# EasyEDA Pro project project-rp2350-board.epro, schematic Schematic1
Board Name: Board1; Create Date: 2025-04-15; Page Name: P1; Project Name: rp2350-impa-noaouto; Schematic Name: Schematic1; Update Date: 2025-06-25; Company: EasyEDA.com; Page Size: A4; Version: V1.0
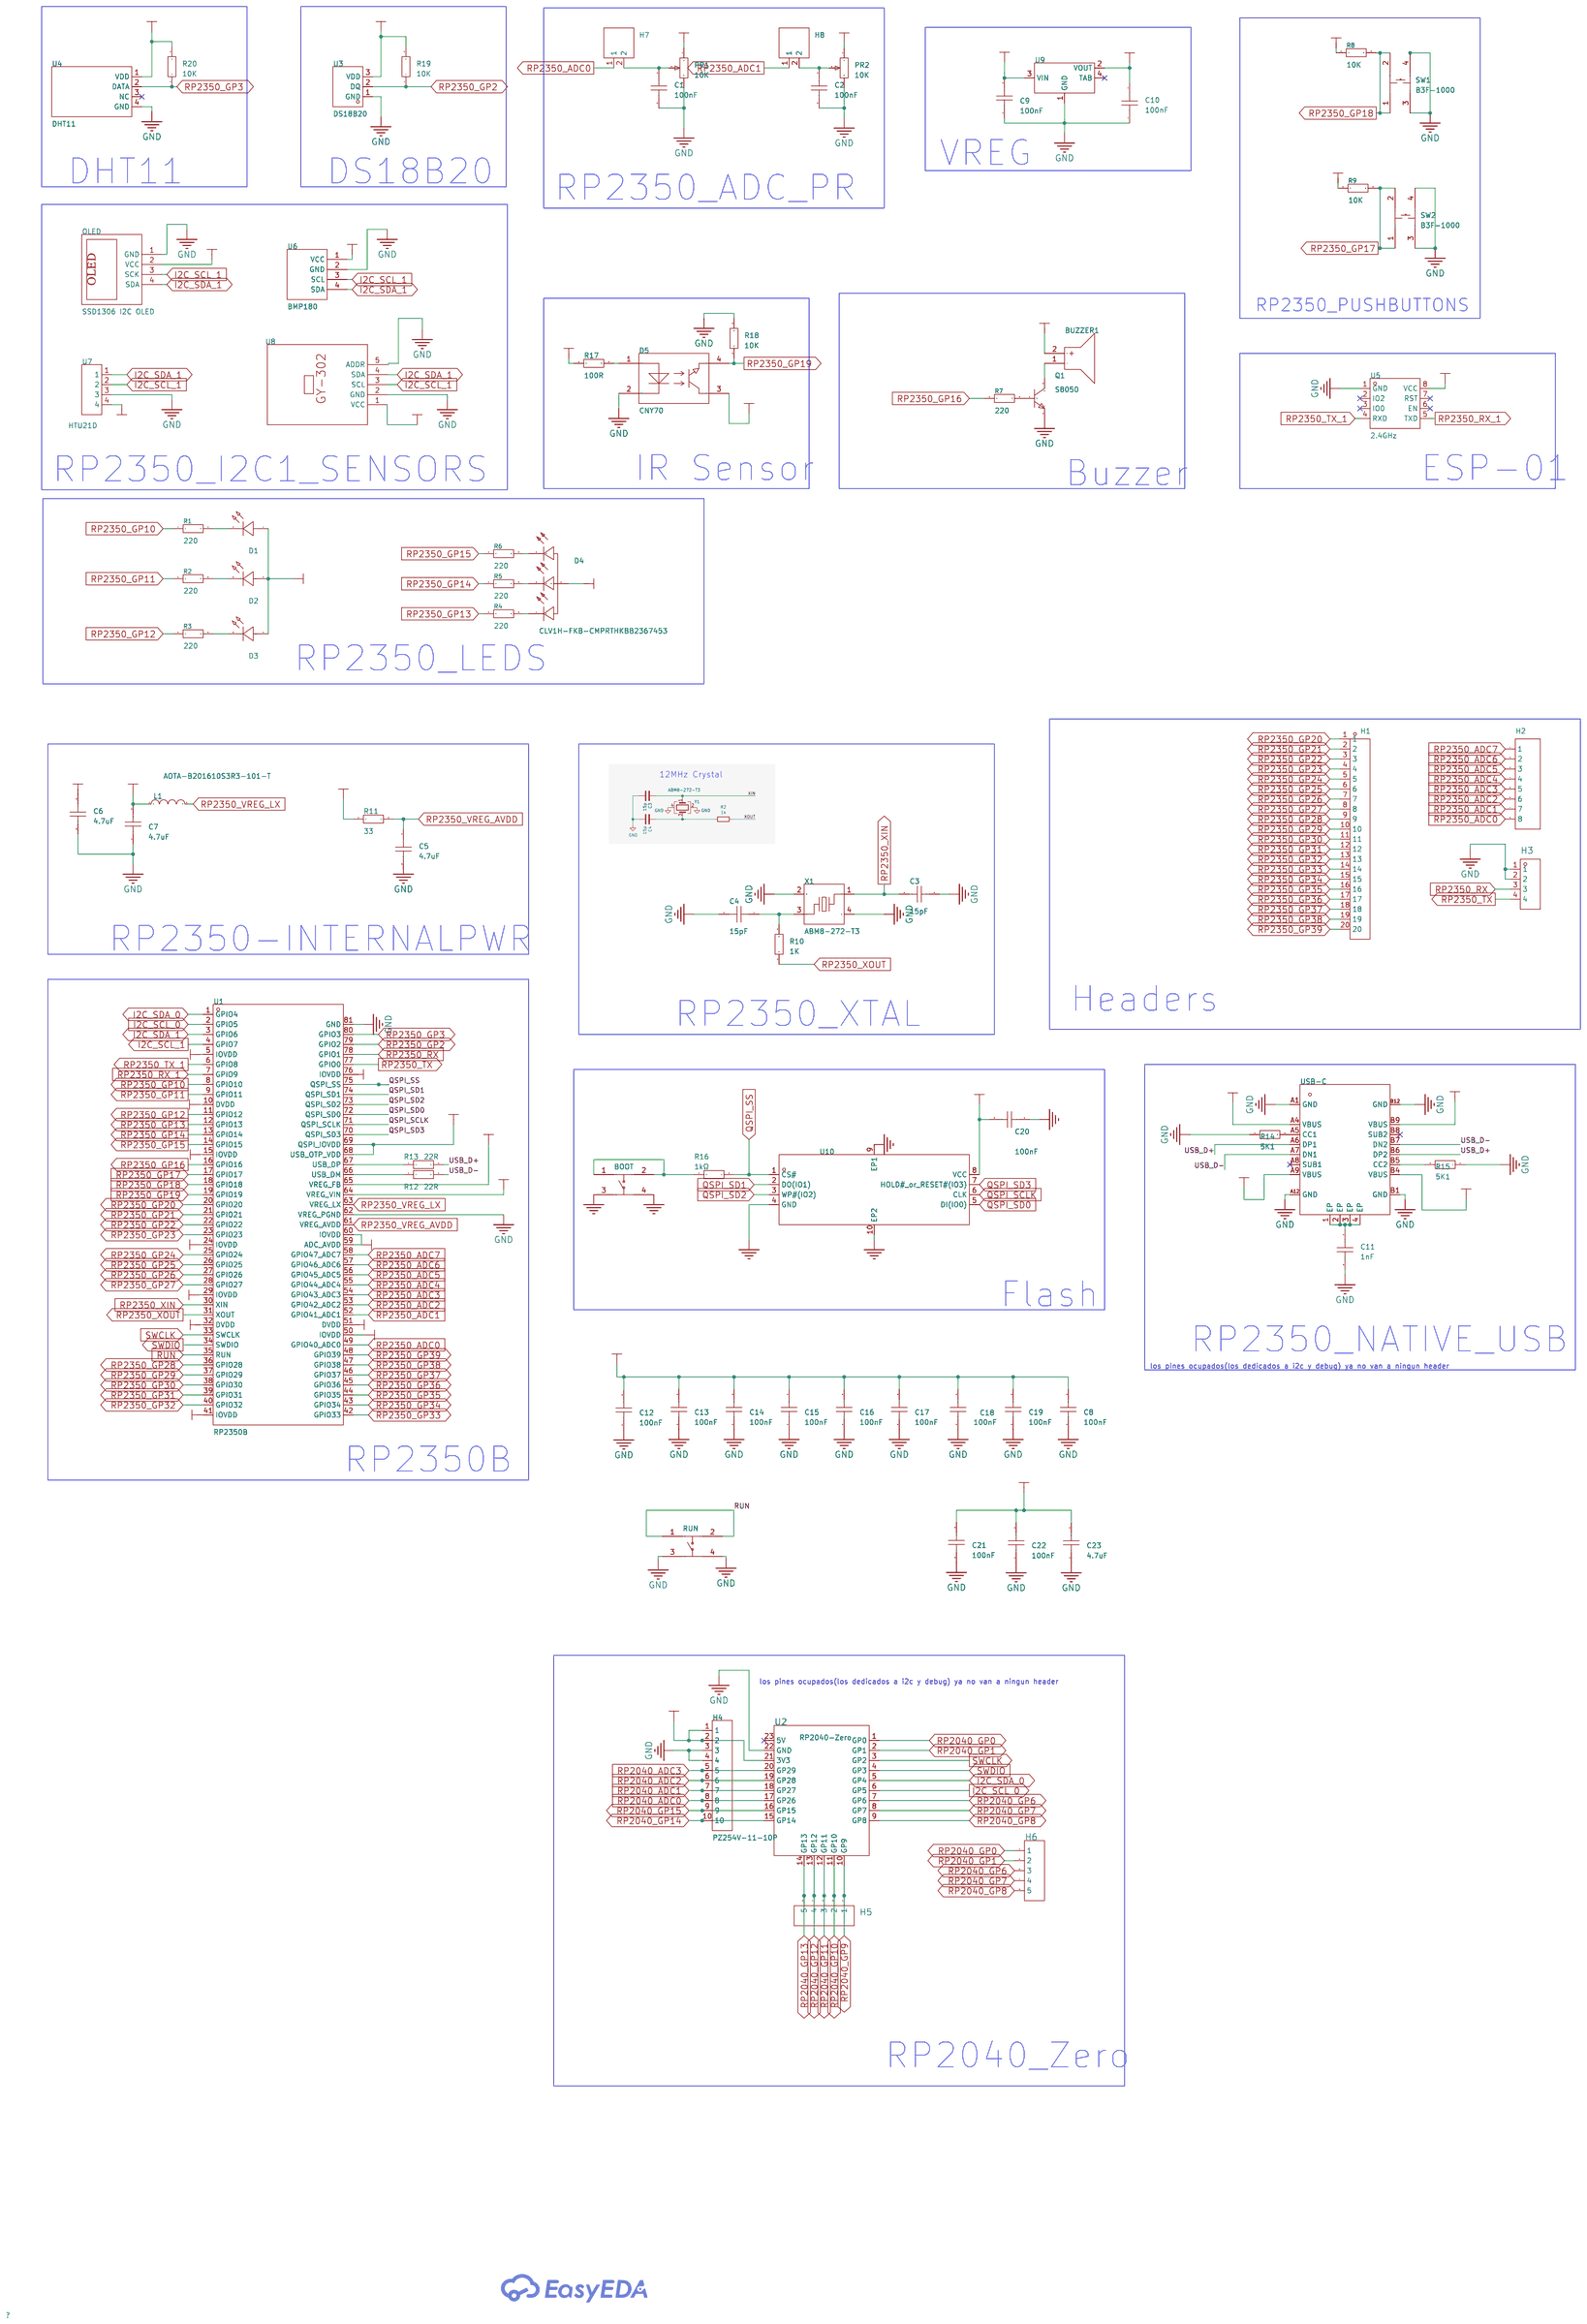
[diagram p0: schematic sheet]

## Parts
BOOT  K2-1808SN-A4SW-01  [KEY-SMD_4P-L4.2-W3.2-P2.20-LS5.1-TL]
BUZZER1  buzzer  [BUZ-TH_BD12.0-P6.00-D0.9-RD]
C1  100nF  [C0603]
C2  100nF  [C0603]
C3  15pF  [C0402]
C4  15pF  [C0402]
C5  4.7uF  [C0603]
C6  4.7uF  [C0603]
C7  4.7uF  [C0603]
C8  100nF  [C0402]
C9  100nF  [C0603]
C10  100nF  [C0603]
C11  1nF  [C0603]
C12  100nF  [C0402]
C13  100nF  [C0402]
C14  100nF  [C0402]
C15  100nF  [C0402]
C16  100nF  [C0402]
C17  100nF  [C0402]
C18  100nF  [C0402]
C19  100nF  [C0402]
C20  100nF  [C0603]
C21  100nF  [C0402]
C22  100nF  [C0402]
C23  4.7uF  [C0402]
D1  YLED0805W  [LED0805-R-RD_WHITE]
D2  YLED0805W  [LED0805-R-RD_WHITE]
D3  YLED0805W  [LED0805-R-RD_WHITE]
D4  CLV1H-FKB-CMPRTHKBB2367453  [LED-SMD_4P-L3.2-W2.8-LS3.5-TL-B]
D5  CNY70  [OPTO-TH_CNY70]
H1  -  [HDR-TH_20P-P2.54-V-M-1]
H2  -  [HDR-TH_8P-P2.54-V-M]
H3  -  [HDR-TH_4P-P2.54-V-F]
H4  PZ254V-11-10P  [HDR-TH_10P-P2.54-V-M-1]
H5  -  [HDR-TH_5P-P2.54-V-F]
H6  -  [HDR-TH_5P-P2.54-V-F]
H7  -  [HDR-TH_2P-P2.54-V-M-1]
H8  -  [HDR-TH_2P-P2.54-V-M-1]
L1  AOTA-B201610S3R3-101-T  [IND-SMD_L2.0-W1.6_AOTA-B201610S3R3-101-T]
OLED  SSD1306 I2C OLED  [OLED_0.91_128X32]
PR1  10K  [RES-ADJ-TH_3P-L9.5-W9.5-P2.54-BR-BS]
PR2  10K  [RES-ADJ-TH_3P-L9.5-W9.5-P2.54-BR-BS]
Q1  S8050  [SOT-23-3_L2.9-W1.3-P1.90-LS2.4-BR]
R1  33kΩ  [R0805]
R2  33kΩ  [R0805]
R3  33kΩ  [R0805]
R4  33kΩ  [R0805]
R5  33kΩ  [R0805]
R6  33kΩ  [R0805]
R7  33kΩ  [R0805]
R8  33kΩ  [R0805]
R9  33kΩ  [R0805]
R10  1K  [R0805]
R11  33  [R0805]
R12  22R  [R0805]
R13  22R  [R0805]
R14  5K1  [R0805]
R15  5K1  [R0805]
R16  1kΩ  [R0805]
R17  100R  [R0805]
R18  10K  [R0805]
R19  10K  [R0805]
R20  10K  [R0805]
RUN  K2-1808SN-A4SW-01  [KEY-SMD_4P-L4.2-W3.2-P2.20-LS5.1-TL]
SW1  B3F-1000  [KEY-TH_4P-L6.2-W6.2-P4.50-LS6.5]
SW2  B3F-1000  [KEY-TH_4P-L6.2-W6.2-P4.50-LS6.5]
U1  RP2350B  [QFN-80_L10.0-W10.0-P0.40-TL-EP3.4]
U2  RP2040-Zero  [COMM-SMD_RP2040-ZERO]
U3  DS18B20  [TO-92-3_L4.8-W3.7-P2.54-R]
U4  DHT11  [SENSOR-TH_DHT11_90DEG]
U5  2.4GHz  [WIFIM-TH_8P-L24.7-W14.4-P2.54]
U6  BMP180  [BMP-180]
U7  HTU21D  [HDR-TH_4P-P2.54-V-M]
U8  -  [GY-302 (BH1750)]
U9  -  [SOT-223-4_L6.5-W3.5-P2.30-LS7.0-BR]
U10  W25Q32JVUUIQ  [USON-8_L4.0-W3.0-P0.80-BL_WINBOND_UU]
USB-C  -  [USB-C-SMD_KH-TYPE-C-16P]
X1  ABM8-272-T3  [CRYSTAL-SMD_4P-L3.2-W2.5-BL]

## Library data of the parts
BOOT RUN = K2-1808SN-A4SW-01: 触点电流:50mA;额定电压(DC):12V;绝缘电阻:100MΩ;电路结构:单刀单掷;安装方式:立贴;按钮形状:椭圆形按钮;带灯:-;作用力:250gf@±30gf;机械寿命:100000;工作温度:-25℃~+85℃;开关长度:4.2mm;开关宽度:3.25mm;开关高度:2.5mm;; Circuit: 单刀单掷; Supplier: LCSC; Datasheet: https://atta.szlcsc.com/upload/public/pdf/source/20180927/C283535_7E7907F3E7B6C1691E1DC87E363D082A.pdf; Manufacturer: 韩国韩荣; Switch Width: 3.25mm; Supplier Part: C92589; Switch Height: 2.5mm; Switch Length: 4.2mm; Actuator Style: 椭圆形按钮; LCSC Part Name: 4.2mm*3.25mm; Mounting Sytle: 立贴; Contact Current: 50mA; Mechanical Life: 100000; Operating Force: 250gf@±30gf; JLCPCB Part Class: Extended Part; Supplier Footprint: SMD; Voltage Rating (DC): 12V; Insulation Resistance: 100MΩ; Operating Temperature: -25℃~+85℃
BUZZER1 = buzzer: Supplier Part: C9900014030; JLCPCB Part Class: Extended Part; Supplier: LCSC
C1-C19 C21-C23 = CAP_0201: Supplier Footprint: 0201
C20 = UMK105B7104KVHF: 容值:100nF;精度:±10%;额定电压:50V;材质(温度系数):X7R;; Supplier: LCSC; Datasheet: https://atta.szlcsc.com/upload/public/pdf/source/20190415/C386112_8E88B4AA4AA3A856ADC8B10D69A4BB16.pdf; Tolerance: ±10%; Manufacturer: TAIYO YUDEN(太诱); Supplier Part: C386112; Voltage Rated: 50V; LCSC Part Name: 100nF ±10% 50V UMK105B7104KVHF; JLCPCB Part Class: Extended Part; Supplier Footprint: 0402; Temperature Coefficient: X7R
D1-D3 = YLED0805W: LCSC Part Name: 发光管; Supplier Part: C25170729; Manufacturer: YONGYUTAI(永裕泰); Supplier Footprint: 0805; JLCPCB Part Class: Extended Part; Datasheet: https://atta.szlcsc.com/upload/public/pdf/source/20240703/126B208D660AB42951DB015B878B749A.pdf; Supplier: LCSC
D4 = CLV1H-FKB-CMPRTHKBB2367453: Diode Configuration:Common Anode; Supplier Part: C6883191; Manufacturer: Wolfspeed; Supplier Footprint: PLCC-4; JLCPCB Part Class: Extended Part; Supplier: LCSC; Diode Configuration: Common Anode
D5 = CNY70: Sensing Distance:5mm Collector Current (Max):50mA; Supplier Part: C145423; Manufacturer: VISHAY(威世); Supplier Footprint: DIP-4; JLCPCB Part Class: Extended Part; Datasheet: https://atta.szlcsc.com/upload/public/pdf/source/20180326/C145423_9D1136DA6C3FD873F3917394B0597A1E.pdf; Supplier: LCSC; Sensing Distance: 5mm; Collector Current (Max): 50mA
H1 = HDR-M_2.54_1x20P: Supplier Footprint: Through
H2 = HDR-M_2.54_1x8P: Supplier Footprint: Through
H3 = HDR-F_2.54_1x4P: Supplier Footprint: Through
H4 = PZ254V-11-10P: Pin Structure:1x10P Pitch:2.54mm Row Spacing:- Circluar Pins/Square Pins:Policy Mounting Type:Straight Number of Rows:Single Row Number of Pins:10P Current Rating:- Voltage Rating (Max):- Length of Mating Pin:6mm Insulation Height:2.5mm Length of End Conn; LCSC Part Name: 1x10P 间距:2.54mm 方针 直插; Supplier Part: C492409; Manufacturer: XFCN(兴飞); Supplier Footprint: 插件,P=2.54mm; JLCPCB Part Class: Extended Part; Datasheet: https://atta.szlcsc.com/upload/public/pdf/source/20200309/C492409_129C9431BDD62EBBBD0A643B6AAB9FBD.pdf; Supplier: LCSC; Pin Structure: 1x10P; Pitch: 2.54mm; Circluar Pins/Square Pins: Policy; Mounting Type: Straight; Number of Rows: Single Row; Number of Pins: 10P; Length of Mating Pin: 6mm; Insulation Height: 2.5mm; Length of End Connection Pin: 3mm; Contact Material: Brass; Operating Temperature: -40℃~+105℃; Color: Black
H5 H6 = HDR-F_2.54_1x5P: Supplier Footprint: Through
H7 H8 = HDR-M_2.54_1x2P: Supplier Footprint: Through
L1 = AOTA-B201610S3R3-101-T: Supplier Part: C42411119; Manufacturer: ABRACON; Supplier Footprint: 0806; JLCPCB Part Class: Extended Part; Datasheet: https://atta.szlcsc.com/upload/public/pdf/source/20241210/8ED7235334351200B2CE75E3CBC0DAAD.pdf; Supplier: LCSC
OLED = OLED 0.91
PR1 PR2 = R_3386P: Supplier Footprint: Through
Q1 = S8050_C2992076: Supplier Part: C2992076; Manufacturer: 星海; Supplier Footprint: SOT-23; JLCPCB Part Class: Extended Part; Datasheet: https://atta.szlcsc.com/upload/public/pdf/source/20220412/23B2261F7486AF0B250D66C32D3117E2.pdf; Supplier: LCSC
R1-R9 = 0805W8F3302T5E: Type:Thick Film Resistors Resistance:33kΩ Tolerance:±1% Tolerance:±1% Power(Watts): Overload Voltage (Max): Temperature Coefficient:±100ppm/℃ Temperature Coefficient:±100ppm/℃ Operating Temperature Range:-55℃~+155℃ Operating Temperature Range:-55℃~+155℃; LCSC Part Name: 33kΩ ±1% 125mW 厚膜电阻; Supplier Part: C17633; Manufacturer: UNI-ROYAL(厚声); Supplier Footprint: 0805; JLCPCB Part Class: Basic Part; Datasheet: https://atta.szlcsc.com/upload/public/pdf/source/20200306/C422600_1E6D84923E4A46A82E41ADD87F860B5C.pdf; Supplier: LCSC; Type: Thick Film Resistors; Tolerance: ±1%; Temperature Coefficient: ±100ppm/℃; Operating Temperature Range: -55℃~+155℃
R10 R11 R14 R15 R17-R20 = Res_0603: Supplier Footprint: 0603
R12 R13 = FRC0603J103 TS: Type:Thick Film Resistors Resistance:10kΩ Tolerance:±5% Tolerance:±5% Power(Watts):0.1W Voltage-Supply(Max):75V Temperature Coefficient:±100ppm/℃ Temperature Coefficient:±100ppm/℃ Operating Temperature:-55℃~+155℃ Operating Temperature:-55℃~+155℃; LCSC Part Name: 10kΩ ±5% 100mW 厚膜电阻; Supplier Part: C2930027; Manufacturer: FOJAN(富捷); Supplier Footprint: 0603; JLCPCB Part Class: Extended Part; Datasheet: https://atta.szlcsc.com/upload/public/pdf/source/20211221/925EC7D7225764EE0046F22065062C87.pdf; Supplier: LCSC; Type: Thick Film Resistors; Tolerance: ±5%; Power(Watts): 0.1W; Voltage-Supply(Max): 75V; Temperature Coefficient: ±100ppm/℃; Operating Temperature: -55℃~+155℃
R16 = 0402WGJ0102TCE: 电阻类型:厚膜电阻;阻值:1kΩ;精度:±5%;功率:62.5mW;; Type: 厚膜电阻; Supplier: LCSC; Datasheet: https://atta.szlcsc.com/upload/public/pdf/source/20200306/C422600_1E6D84923E4A46A82E41ADD87F860B5C.pdf; Tolerance: ±5%; Manufacturer: UNI-ROYAL(厚声); Power(Watts): 62.5mW; Supplier Part: C25543; LCSC Part Name: 1kΩ ±5% 62.5mW; JLCPCB Part Class: Extended Part; Supplier Footprint: 0402; Overload Voltage (Max): 50V; Temperature Coefficient: ±100ppm/℃; Operating Temperature Range: -55℃~+155℃
SW1 SW2 = B3F-1000: Circuit:SPST Actuator Style:Round Button Mounting Style:- Switch Length:6mm Switch Width:6mm Switch Height:4.3mm Contact Current:50mA Voltage Rating (DC):24V With Lamp:- Mechanical Life:-; Supplier Part: C93157; Manufacturer: OMRON(欧姆龙); Supplier Footprint: 插件-4P,6x6mm; JLCPCB Part Class: Extended Part; Supplier: LCSC; Circuit: SPST; Actuator Style: Round Button; Switch Length: 6mm; Switch Width: 6mm; Switch Height: 4.3mm; Contact Current: 50mA; Voltage Rating (DC): 24V
U1 = RP2350B_C42415655: Supplier Part: C42415655; Manufacturer: Raspberry Pi(树莓派); Supplier Footprint: QFN-80-EP(10x10); JLCPCB Part Class: Extended Part; Datasheet: https://atta.szlcsc.com/upload/public/pdf/source/20241210/0989AB86AAD7A21936E5CD12ADC9EA29.pdf; Supplier: LCSC
U2 = RP2040-Zero: LCSC Part Name: 微雪 树莓派RP2040-Zero微控制器 PICO开发板 RP2040双核处理器; Supplier Part: C5350143; Manufacturer: Waveshare(微雪电子); Supplier Footprint: LCC-22(18x23.5); JLCPCB Part Class: Extended Part; Datasheet: https://atta.szlcsc.com/upload/public/pdf/source/20230328/F7ADB41143C3623278858A7E8047DBCD.pdf; Supplier: LCSC
U3 = DS18B20_C5451632: Temperature Range:-10℃~70℃ Temperature Range:-10℃~70℃ Tolerance:±0.4℃ Tolerance:±0.4℃ Voltage - Supply:2.5V~5.5V Voltage - Supply:2.5V~5.5V Standby Current:- Interface:-; LCSC Part Name: 温度-10℃~70℃ 精度±0.4℃ 电压2.5V~5.5V; Supplier Part: C5451632; Manufacturer: HXY MOSFET(华轩阳电子); Supplier Footprint: TO-92; JLCPCB Part Class: Extended Part; Datasheet: https://atta.szlcsc.com/upload/public/pdf/source/20230427/F43BF9FBC8AD29BCFCC811AFA154CBDD.pdf; Supplier: LCSC; Temperature Range: -10℃~70℃; Tolerance: ±0.4℃; Voltage - Supply: 2.5V~5.5V
U4 = DHT11_C117051: LCSC Part Name: 新款电容式数字温湿度传感器,老款已停产16.1x12.6x5.8mm DHT11  电容式传感器; Supplier Part: C117051; Manufacturer: 广州奥松; Supplier Footprint: SIP-4; JLCPCB Part Class: Extended Part; Datasheet: https://atta.szlcsc.com/upload/public/pdf/source/20170703/1499081238365.pdf; Supplier: LCSC
U5 = ESP-01S_C503582: Core Processor:ESP8266芯片 Wireless Standard:- Support Interface:GPIO；UART；PWM Frequency:2.4GHz Antenna Type:板载PCBAntenna Output Power:16dBm Output Power:16dBm Operating Voltage:3V~3.6V Operating Voltage:3V~3.6V Receive  Current:56mA Send  Current:170mA Sen; LCSC Part Name: 完整的802.11b/g/nWi-FiSoC模块; Supplier Part: C503582; Manufacturer: Ai-Thinker(安信可); Manufacturer Part: ESP-01S; JLCPCB Part Class: Extended Part; Datasheet: https://atta.szlcsc.com/upload/public/pdf/source/20200407/C503582_1139AF8FB42E05635FA0089E1752A536.pdf; Supplier: LCSC; Core Processor: ESP8266芯片; Support Interface: GPIO；UART；PWM; Antenna Type: 板载PCBAntenna; Output Power: 16dBm; Operating Voltage: 3V~3.6V; Receive  Current: 56mA; Send  Current: 170mA; Sensitivity: -90dBm; Operating Temperature: -20℃~+70℃
U6 = BMP180: 3DModel: BMP180V1 COPY COPY COPY
U7 = HDR-M_2.54_1x4P: Supplier Footprint: Through
U8 = GY-302 Light Sensor Module (BH1750)
U9 = AMS1117-3.3V: Supplier Footprint: SOT-223
U10 = W25Q32JVUUIQ: 3V 32M-BIT SERIAL FLASH MEMORY WITH DUAL, QUAD SPI; Supplier Part: C2999380; Manufacturer: WINBOND(华邦); Supplier Footprint: USON-8(3x4); JLCPCB Part Class: 扩展库; Datasheet: https://atta.szlcsc.com/upload/public/pdf/source/20220419/71F2D20BDA1217995CECC027DED216BE.pdf; Supplier: LCSC
USB-C = USB_TYPE-C-16P: Supplier Footprint: Through
X1 = ABM8-272-T3_C20625731: Supplier Part: C20625731; Manufacturer: ABRACON; Supplier Footprint: SMD3225-4P; JLCPCB Part Class: Extended Part; Datasheet: https://atta.szlcsc.com/upload/public/pdf/source/20240227/A8BE43F636D80F75C9AF5C59EDF21E9A.pdf; Supplier: LCSC

## Nets
1V1: C7.2 C21.2 C22.2 C23.2 L1.1 U1.10(DVDD) U1.32(DVDD) U1.65(VREG_FB)
3V3: C6.1 C8.2 C10.2 C12.2 C13.2 C14.2 C15.2 C16.2 C17.2 C18.2 C19.2 C20.2 D1.1(A) D2.1(A) D3.1(A) D4.1 D5.3 H4.1 H4.2 OLED.2(VCC) PR1.1 PR2.1 R8.1 R9.1 R11.1 R17.1 R19.2 R20.2 U1.5(IOVDD) U1.15(IOVDD) U1.29(IOVDD) U1.41(IOVDD) U1.59(ADC_AVDD) U1.60(IOVDD) U1.64(VREG_VIN) U1.68(USB_OTP_VDD) U1.69(QSPI_IOVDD) U1.76(IOVDD) U2.21(3V3) U3.3(VDD) U4.1(VDD) U5.8(VCC) U6.1(VCC) U7.4 U8.1(VCC) U9.2(VOUT) U10.8(VCC)
5V: BUZZER1.2(+) C9.2 U9.3(VIN) USB-C.A4(VBUS) USB-C.A9(VBUS) USB-C.B9(VBUS)
GND: BOOT.3 BOOT.4 C1.2 C2.2 C3.1 C4.2 C5.2 C6.2 C7.1 C8.1 C9.1 C10.1 C11.2 C12.1 C13.1 C14.1 C15.1 C16.1 C17.1 C18.1 C19.1 C20.1 C21.1 C22.1 C23.1 D5.2 H3.1 H3.2 H4.3 H4.4 OLED.1(GND) PR1.3 PR2.3 Q1.2(E) R14.1 R15.1 R18.2 RUN.3 RUN.4 SW1.3 SW1.4 SW2.3 SW2.4 U1.62(VREG_PGND) U1.81(GND) U2.22(GND) U3.1(GND) U4.4(GND) U5.1(GND) U6.2(GND) U7.3 U8.2(GND) U8.5(ADDR) U9.1(GND) U10.4(GND) U10.9(EP1) U10.10(EP2) USB-C.A1(GND) USB-C.A12(GND) USB-C.B1(GND) USB-C.B12(GND) X1.2(GND) X1.4(GND)
I2C_SCL_0: U1.2(GPIO5) U2.6(GP5)
I2C_SCL_1: OLED.3(SCK) U1.4(GPIO7) U6.3(SCL) U7.2 U8.3(SCL)
I2C_SDA_0: U1.1(GPIO4) U2.5(GP4)
I2C_SDA_1: OLED.4(SDA) U1.3(GPIO6) U6.4(SDA) U7.1 U8.4(SDA)
QSPI_SCLK: U1.71(QSPI_SCLK) U10.6(CLK)
QSPI_SD0: U1.72(QSPI_SD0) U10.5(DI(IO0))
QSPI_SD1: U1.74(QSPI_SD1) U10.2(DO(IO1))
QSPI_SD2: U1.73(QSPI_SD2) U10.3(WP#(IO2))
QSPI_SD3: U1.70(QSPI_SD3) U10.7(HOLD# or RESET#(IO3))
QSPI_SS: R16.2 U1.75(QSPI_SS) U10.1(CS#)
RP2040_ADC0: U2.17(GP26)
RP2040_ADC1: U2.18(GP27)
RP2040_ADC2: U2.19(GP28)
RP2040_ADC3: U2.20(GP29)
RP2040_GP0: H6.1 U2.1(GP0)
RP2040_GP1: H6.2 U2.2(GP1)
RP2040_GP6: H6.3 U2.7(GP6)
RP2040_GP7: H6.4 U2.8(GP7)
RP2040_GP8: H6.5 U2.9(GP8)
RP2040_GP9: H5.1 U2.10(GP9)
RP2040_GP10: H5.2 U2.11(GP10)
RP2040_GP11: H5.3 U2.12(GP11)
RP2040_GP12: H5.4 U2.13(GP12)
RP2040_GP13: H5.5 U2.14(GP13)
RP2040_GP14: U2.15(GP14)
RP2040_GP15: U2.16(GP15)
RP2350_ADC0: H2.8 H7.1 U1.49(GPIO40_ADC0)
RP2350_ADC1: H2.7 H8.1 U1.52(GPIO41_ADC1)
RP2350_ADC2: H2.6 U1.53(GPIO42_ADC2)
RP2350_ADC3: H2.5 U1.54(GPIO43_ADC3)
RP2350_ADC4: H2.4 U1.55(GPIO44_ADC4)
RP2350_ADC5: H2.3 U1.56(GPIO45_ADC5)
RP2350_ADC6: H2.2 U1.57(GPIO46_ADC6)
RP2350_ADC7: H2.1 U1.58(GPIO47_ADC7)
RP2350_GP2: R19.1 U1.79(GPIO2) U3.2(DQ)
RP2350_GP3: R20.1 U1.80(GPIO3) U4.2(DATA)
RP2350_GP10: R1.1 U1.8(GPIO10)
RP2350_GP11: R2.1 U1.9(GPIO11)
RP2350_GP12: R3.1 U1.11(GPIO12)
RP2350_GP13: R4.1 U1.12(GPIO13)
RP2350_GP14: R5.1 U1.13(GPIO14)
RP2350_GP15: R6.1 U1.14(GPIO15)
RP2350_GP16: R7.1 U1.16(GPIO16)
RP2350_GP17: R9.2 SW2.1 SW2.2 U1.17(GPIO17)
RP2350_GP18: SW1.1 SW1.2 U1.18(GPIO18)
RP2350_GP19: D5.4 R18.1 U1.19(GPIO19)
RP2350_GP20: H1.1 U1.20(GPIO20)
RP2350_GP21: H1.2 U1.21(GPIO21)
RP2350_GP22: H1.3 U1.22(GPIO22)
RP2350_GP23: H1.4 U1.23(GPIO23)
RP2350_GP24: H1.5 U1.25(GPIO24)
RP2350_GP25: H1.6 U1.26(GPIO25)
RP2350_GP26: H1.7 U1.27(GPIO26)
RP2350_GP27: H1.8 U1.28(GPIO27)
RP2350_GP28: H1.9 U1.36(GPIO28)
RP2350_GP29: H1.10 U1.37(GPIO29)
RP2350_GP30: H1.11 U1.38(GPIO30)
RP2350_GP31: H1.12 U1.39(GPIO31)
RP2350_GP32: H1.13 U1.40(GPIO32)
RP2350_GP33: H1.14 U1.42(GPIO33)
RP2350_GP34: H1.15 U1.43(GPIO34)
RP2350_GP35: H1.16 U1.44(GPIO35)
RP2350_GP36: H1.17 U1.45(GPIO36)
RP2350_GP37: H1.18 U1.46(GPIO37)
RP2350_GP38: H1.19 U1.47(GPIO38)
RP2350_GP39: H1.20 U1.48(GPIO39)
RP2350_RX: H3.3 U1.78(GPIO1)
RP2350_RX_1: U1.7(GPIO9) U5.5(TXD)
RP2350_TX: H3.4 U1.77(GPIO0)
RP2350_TX_1: U1.6(GPIO8) U5.4(RXD)
RP2350_VREG_AVDD: C5.1 R11.2 U1.61(VREG_AVDD)
RP2350_VREG_LX: L1.2 U1.63(VREG_LX)
RP2350_XIN: C3.2 U1.30(XIN) X1.1
RP2350_XOUT: R10.1 U1.31(XOUT)
RUN: RUN.1 RUN.2 U1.35(RUN)
SWCLK: U1.33(SWCLK) U2.3(GP2)
SWDIO: U1.34(SWDIO) U2.4(GP3)
USB_D+: R13.2 USB-C.A6(DP1) USB-C.B6(DP2)
USB_D-: R12.2 USB-C.A7(DN1) USB-C.B7(DN2)
$1N3968: D1.2(K) R1.2
$1N3972: D2.2(K) R2.2
$1N3977: D3.2(K) R3.2
$1N4236: Q1.1(B) R7.2
$1N7540: C1.1 H7.2 PR1.2
$1N7663: C2.1 H8.2 PR2.2
$1N8203: C4.1 R10.2 X1.3
$1N10864: R12.1 U1.66(USB_DM)
$1N10892: R13.1 U1.67(USB_DP)
$1N15103: R14.2 USB-C.A5(CC1)
$1N15154: R15.2 USB-C.B5(CC2)
$1N16516: C11.1 USB-C.1(EP) USB-C.2(EP) USB-C.3(EP) USB-C.4(EP)
$1N20125: BOOT.1 BOOT.2 R16.1
$1N39889: D4.4 R4.2
$1N39893: D4.3 R5.2
$1N39897: D4.2 R6.2
$1N45855: D5.1 R17.2
Net-(BUZZER1-1): BUZZER1.1(-) Q1.3(C)

Not connected (* = marked no-connect by the designer): H4 5 6 7 8 9 10; R8 2; U1 24(IOVDD) 50(IOVDD) 51(DVDD); U2 23(5V)*; U4 3(NC)*; U5 2(IO2)* 3(IO0)* 6(EN)* 7(RST)*; U9 4(TAB)*; USB-C A8(SUB1)* B4(VBUS) B8(SUB2)*

## Notes on the sheet
- VREG
- DHT11
- DS18B20
- RP2350_ADC_PR
- RP2350_PUSHBUTTONS
- RP2350_I2C1_SENSORS
- IR Sensor
- ESP-01
- Buzzer
- RP2350_LEDS
- RP2350-INTERNALPWR
- Headers
- RP2350_XTAL
- Flash
- RP2350_NATIVE_USB
- los pines ocupados(los dedicados a i2c y debug) ya no van a ningun header
- RP2350B
- los pines ocupados(los dedicados a i2c y debug) ya no van a ningun header
- RP2040_Zero
